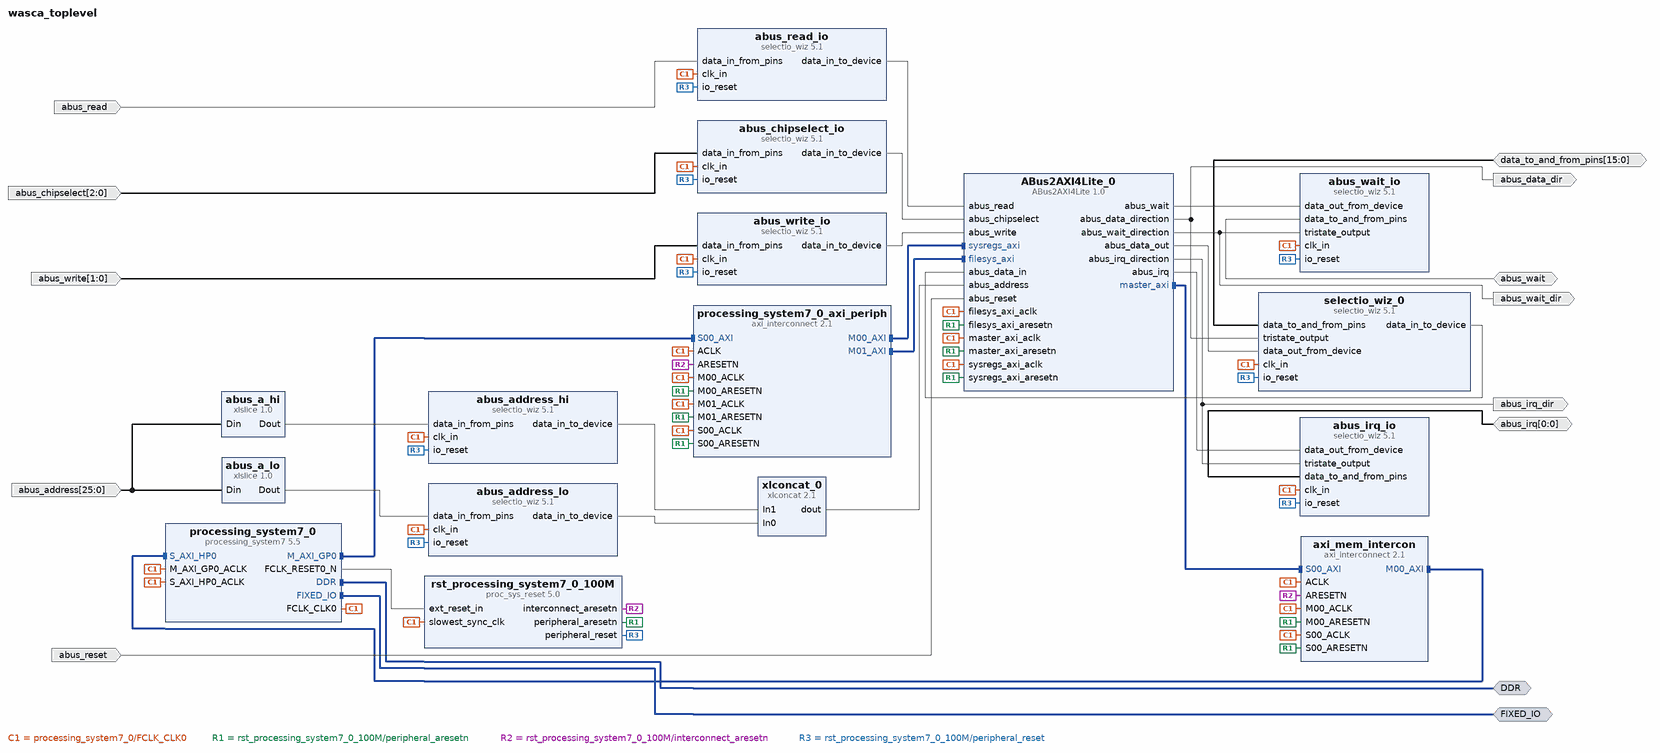
[diagram p0: block diagram of the top level]
# Vivado block design wasca_toplevel, Vivado 2016.2
create_bd_design wasca_toplevel

create_bd_intf_port -mode Master -vlnv xilinx.com:interface:ddrx_rtl:1.0 DDR
create_bd_intf_port -mode Master -vlnv xilinx.com:display_processing_system7:fixedio_rtl:1.0 FIXED_IO
create_bd_port -dir IO -from 15 -to 0 data_to_and_from_pins
create_bd_port -dir I -from 2 -to 0 abus_chipselect
create_bd_port -dir I abus_read
create_bd_port -dir I abus_reset
create_bd_port -dir IO -from 0 -to 0 abus_irq
create_bd_port -dir I -from 1 -to 0 abus_write
create_bd_port -dir IO abus_wait
create_bd_port -dir I -from 25 -to 0 abus_address
create_bd_port -dir O abus_data_dir
create_bd_port -dir O abus_irq_dir
create_bd_port -dir O abus_wait_dir

create_bd_cell -type ip -vlnv xilinx.com:ip:processing_system7:5.5 processing_system7_0
set_property -dict [list \
  CONFIG.PCW_FCLK_CLK0_BUF true \
  CONFIG.PCW_UIPARAM_DDR_FREQ_MHZ 400 \
  CONFIG.PCW_APU_PERIPHERAL_FREQMHZ 667 \
  CONFIG.PCW_SDIO_PERIPHERAL_FREQMHZ 100 \
  CONFIG.PCW_UART_PERIPHERAL_FREQMHZ 50 \
  CONFIG.PCW_FPGA0_PERIPHERAL_FREQMHZ 100 \
  CONFIG.PCW_FPGA1_PERIPHERAL_FREQMHZ 10 \
  CONFIG.PCW_FPGA2_PERIPHERAL_FREQMHZ 10 \
  CONFIG.PCW_FPGA3_PERIPHERAL_FREQMHZ 10 \
  CONFIG.PCW_USE_S_AXI_HP0 1 \
  CONFIG.PCW_S_AXI_HP0_DATA_WIDTH 32 \
  CONFIG.PCW_PRESET_BANK0_VOLTAGE {LVCMOS 1.8V} \
  CONFIG.PCW_PRESET_BANK1_VOLTAGE {LVCMOS 1.8V} \
  CONFIG.PCW_UIPARAM_DDR_MEMORY_TYPE {LPDDR 2} \
  CONFIG.PCW_UIPARAM_DDR_PARTNO Custom \
  CONFIG.PCW_QSPI_PERIPHERAL_ENABLE 1 \
  CONFIG.PCW_QSPI_GRP_SINGLE_SS_ENABLE 1 \
  CONFIG.PCW_QSPI_GRP_SINGLE_SS_IO {MIO 1 .. 6} \
  CONFIG.PCW_QSPI_GRP_FBCLK_ENABLE 1 \
  CONFIG.PCW_SD0_PERIPHERAL_ENABLE 1 \
  CONFIG.PCW_SD0_SD0_IO {MIO 16 .. 21} \
  CONFIG.PCW_SD0_GRP_WP_ENABLE 1 \
  CONFIG.PCW_SD0_GRP_WP_IO {MIO 22} \
  CONFIG.PCW_SD1_PERIPHERAL_ENABLE 1 \
  CONFIG.PCW_SD1_SD1_IO {MIO 10 .. 15} \
  CONFIG.PCW_UART0_PERIPHERAL_ENABLE 1 \
  CONFIG.PCW_UART0_UART0_IO {MIO 50 .. 51} \
  CONFIG.PCW_SPI0_PERIPHERAL_ENABLE 1 \
  CONFIG.PCW_SPI0_SPI0_IO {MIO 28 .. 33} \
  CONFIG.PCW_SPI0_GRP_SS1_ENABLE 1 \
  CONFIG.PCW_SPI0_GRP_SS2_ENABLE 1 \
  CONFIG.PCW_SPI1_PERIPHERAL_ENABLE 1 \
  CONFIG.PCW_SPI1_SPI1_IO {MIO 46 .. 51} \
  CONFIG.PCW_USB_RESET_ENABLE 1 \
  CONFIG.PCW_I2C_RESET_ENABLE 1 \
  CONFIG.PCW_GPIO_PERIPHERAL_ENABLE 1 \
  CONFIG.PCW_GPIO_MIO_GPIO_ENABLE 1 \
  CONFIG.PCW_GPIO_MIO_GPIO_IO MIO \
  CONFIG.PCW_GPIO_EMIO_GPIO_ENABLE 1 \
  CONFIG.PCW_GPIO_EMIO_GPIO_IO 64 \
] [get_bd_cells processing_system7_0]
# 157 more settings of processing_system7_0 are not shown: defaults, MIO pin electricals, DDR timing, and values the tool derives
create_bd_cell -type ip -vlnv xilinx.com:ip:axi_interconnect:2.1 axi_mem_intercon
set_property -dict {CONFIG.NUM_MI 1} [get_bd_cells axi_mem_intercon]
create_bd_cell -type ip -vlnv xilinx.com:ip:proc_sys_reset:5.0 rst_processing_system7_0_100M
create_bd_cell -type ip -vlnv xilinx.com:ip:selectio_wiz:5.1 selectio_wiz_0
set_property -dict [list \
  CONFIG.BUS_DIR BIDIR \
  CONFIG.BUS_IO_STD LVCMOS33 \
  CONFIG.SERIALIZATION_FACTOR 4 \
  CONFIG.SYSTEM_DATA_WIDTH 16 \
  CONFIG.SELIO_INTERFACE_TYPE NETWORKING \
  CONFIG.SELIO_BUS_IN_DELAY NONE \
  CONFIG.SELIO_CLK_IO_STD LVCMOS33 \
  CONFIG.SELIO_CLK_BUF MMCM \
  CONFIG.CLK_FWD false \
  CONFIG.CLK_FWD_IO_STD LVCMOS33 \
] [get_bd_cells selectio_wiz_0]
create_bd_cell -type ip -vlnv xilinx.com:ip:selectio_wiz:5.1 abus_wait_io
set_property -dict [list \
  CONFIG.BUS_DIR BIDIR \
  CONFIG.BUS_IO_STD LVCMOS33 \
  CONFIG.SERIALIZATION_FACTOR 4 \
  CONFIG.SYSTEM_DATA_WIDTH 1 \
  CONFIG.SELIO_INTERFACE_TYPE NETWORKING \
  CONFIG.SELIO_BUS_IN_DELAY NONE \
  CONFIG.SELIO_CLK_IO_STD LVCMOS33 \
  CONFIG.SELIO_CLK_BUF MMCM \
  CONFIG.CLK_FWD false \
  CONFIG.CLK_FWD_IO_STD LVCMOS33 \
] [get_bd_cells abus_wait_io]
create_bd_cell -type ip -vlnv xilinx.com:ip:selectio_wiz:5.1 abus_irq_io
set_property -dict [list \
  CONFIG.BUS_DIR BIDIR \
  CONFIG.BUS_IO_STD LVCMOS33 \
  CONFIG.SERIALIZATION_FACTOR 4 \
  CONFIG.SYSTEM_DATA_WIDTH 1 \
  CONFIG.SELIO_INTERFACE_TYPE NETWORKING \
  CONFIG.SELIO_BUS_IN_DELAY NONE \
  CONFIG.SELIO_CLK_IO_STD LVCMOS33 \
  CONFIG.SELIO_CLK_BUF MMCM \
  CONFIG.CLK_FWD false \
  CONFIG.CLK_FWD_IO_STD LVCMOS33 \
] [get_bd_cells abus_irq_io]
create_bd_cell -type ip -vlnv xilinx.com:ip:selectio_wiz:5.1 abus_read_io
set_property -dict [list \
  CONFIG.BUS_DIR INPUTS \
  CONFIG.BUS_IO_STD LVCMOS33 \
  CONFIG.SERIALIZATION_FACTOR 4 \
  CONFIG.SYSTEM_DATA_WIDTH 1 \
  CONFIG.SELIO_INTERFACE_TYPE NETWORKING \
  CONFIG.SELIO_BUS_IN_DELAY NONE \
  CONFIG.SELIO_CLK_IO_STD LVCMOS33 \
  CONFIG.SELIO_CLK_BUF MMCM \
  CONFIG.CLK_FWD false \
  CONFIG.CLK_FWD_IO_STD LVCMOS33 \
] [get_bd_cells abus_read_io]
create_bd_cell -type ip -vlnv xilinx.com:ip:selectio_wiz:5.1 abus_write_io
set_property -dict [list \
  CONFIG.BUS_DIR INPUTS \
  CONFIG.BUS_IO_STD LVCMOS33 \
  CONFIG.SERIALIZATION_FACTOR 4 \
  CONFIG.SYSTEM_DATA_WIDTH 2 \
  CONFIG.SELIO_INTERFACE_TYPE NETWORKING \
  CONFIG.SELIO_BUS_IN_DELAY NONE \
  CONFIG.SELIO_CLK_IO_STD LVCMOS33 \
  CONFIG.SELIO_CLK_BUF MMCM \
  CONFIG.CLK_FWD false \
  CONFIG.CLK_FWD_IO_STD LVCMOS33 \
] [get_bd_cells abus_write_io]
create_bd_cell -type ip -vlnv xilinx.com:ip:selectio_wiz:5.1 abus_chipselect_io
set_property -dict [list \
  CONFIG.BUS_DIR INPUTS \
  CONFIG.BUS_IO_STD LVCMOS33 \
  CONFIG.SERIALIZATION_FACTOR 4 \
  CONFIG.SYSTEM_DATA_WIDTH 3 \
  CONFIG.SELIO_INTERFACE_TYPE NETWORKING \
  CONFIG.SELIO_BUS_IN_DELAY NONE \
  CONFIG.SELIO_CLK_IO_STD LVCMOS33 \
  CONFIG.SELIO_CLK_BUF MMCM \
  CONFIG.CLK_FWD false \
  CONFIG.CLK_FWD_IO_STD LVCMOS33 \
] [get_bd_cells abus_chipselect_io]
create_bd_cell -type ip -vlnv xilinx.com:ip:xlconcat:2.1 xlconcat_0
create_bd_cell -type ip -vlnv xilinx.com:ip:selectio_wiz:5.1 abus_address_lo
set_property -dict [list \
  CONFIG.BUS_DIR INPUTS \
  CONFIG.BUS_IO_STD LVCMOS33 \
  CONFIG.SERIALIZATION_FACTOR 4 \
  CONFIG.SYSTEM_DATA_WIDTH 16 \
  CONFIG.SELIO_INTERFACE_TYPE NETWORKING \
  CONFIG.SELIO_BUS_IN_DELAY NONE \
  CONFIG.SELIO_CLK_IO_STD LVCMOS33 \
  CONFIG.SELIO_CLK_BUF MMCM \
  CONFIG.CLK_FWD false \
  CONFIG.CLK_FWD_IO_STD LVCMOS33 \
] [get_bd_cells abus_address_lo]
create_bd_cell -type ip -vlnv xilinx.com:ip:selectio_wiz:5.1 abus_address_hi
set_property -dict [list \
  CONFIG.BUS_DIR INPUTS \
  CONFIG.BUS_IO_STD LVCMOS33 \
  CONFIG.SERIALIZATION_FACTOR 4 \
  CONFIG.SYSTEM_DATA_WIDTH 10 \
  CONFIG.SELIO_INTERFACE_TYPE NETWORKING \
  CONFIG.SELIO_BUS_IN_DELAY NONE \
  CONFIG.SELIO_CLK_IO_STD LVCMOS33 \
  CONFIG.SELIO_CLK_BUF MMCM \
  CONFIG.CLK_FWD false \
  CONFIG.CLK_FWD_IO_STD LVCMOS33 \
] [get_bd_cells abus_address_hi]
create_bd_cell -type ip -vlnv xilinx.com:ip:xlslice:1.0 abus_a_lo
set_property -dict {CONFIG.DOUT_WIDTH 16 CONFIG.DIN_TO 0 CONFIG.DIN_FROM 15 CONFIG.DIN_WIDTH 26} [get_bd_cells abus_a_lo]
create_bd_cell -type ip -vlnv xilinx.com:ip:xlslice:1.0 abus_a_hi
set_property -dict {CONFIG.DOUT_WIDTH 10 CONFIG.DIN_TO 16 CONFIG.DIN_FROM 25 CONFIG.DIN_WIDTH 26} [get_bd_cells abus_a_hi]
create_bd_cell -type ip -vlnv xilinx.com:ip:axi_interconnect:2.1 processing_system7_0_axi_periph
set_property -dict {CONFIG.NUM_MI 2} [get_bd_cells processing_system7_0_axi_periph]
create_bd_cell -type ip -vlnv www.wasca.info:user:ABus2AXI4Lite:1.0 ABus2AXI4Lite_0

# ---- connections ----

connect_bd_intf_net [get_bd_intf_pins processing_system7_0/M_AXI_GP0] [get_bd_intf_pins processing_system7_0_axi_periph/S00_AXI]
connect_bd_intf_net [get_bd_intf_pins processing_system7_0_axi_periph/M00_AXI] [get_bd_intf_pins ABus2AXI4Lite_0/sysregs_axi]
connect_bd_intf_net [get_bd_intf_pins axi_mem_intercon/S00_AXI] [get_bd_intf_pins ABus2AXI4Lite_0/master_axi]
connect_bd_intf_net [get_bd_intf_pins processing_system7_0_axi_periph/M01_AXI] [get_bd_intf_pins ABus2AXI4Lite_0/filesys_axi]
connect_bd_intf_net [get_bd_intf_pins axi_mem_intercon/M00_AXI] [get_bd_intf_pins processing_system7_0/S_AXI_HP0]
connect_bd_intf_net [get_bd_intf_ports DDR] [get_bd_intf_pins processing_system7_0/DDR]
connect_bd_intf_net [get_bd_intf_ports FIXED_IO] [get_bd_intf_pins processing_system7_0/FIXED_IO]
connect_bd_net [get_bd_pins processing_system7_0/FCLK_CLK0] \
  [get_bd_pins processing_system7_0/M_AXI_GP0_ACLK] [get_bd_pins rst_processing_system7_0_100M/slowest_sync_clk] \
  [get_bd_pins selectio_wiz_0/clk_in] [get_bd_pins abus_wait_io/clk_in] [get_bd_pins abus_irq_io/clk_in] \
  [get_bd_pins abus_read_io/clk_in] [get_bd_pins abus_write_io/clk_in] [get_bd_pins abus_chipselect_io/clk_in] \
  [get_bd_pins abus_address_hi/clk_in] [get_bd_pins abus_address_lo/clk_in] [get_bd_pins axi_mem_intercon/S00_ACLK] \
  [get_bd_pins axi_mem_intercon/ACLK] [get_bd_pins axi_mem_intercon/M00_ACLK] \
  [get_bd_pins processing_system7_0_axi_periph/S00_ACLK] [get_bd_pins processing_system7_0_axi_periph/ACLK] \
  [get_bd_pins processing_system7_0_axi_periph/M00_ACLK] [get_bd_pins processing_system7_0_axi_periph/M01_ACLK] \
  [get_bd_pins processing_system7_0/S_AXI_HP0_ACLK] [get_bd_pins ABus2AXI4Lite_0/master_axi_aclk] \
  [get_bd_pins ABus2AXI4Lite_0/sysregs_axi_aclk] [get_bd_pins ABus2AXI4Lite_0/filesys_axi_aclk]
connect_bd_net [get_bd_pins processing_system7_0/FCLK_RESET0_N] [get_bd_pins rst_processing_system7_0_100M/ext_reset_in]
connect_bd_net [get_bd_pins rst_processing_system7_0_100M/peripheral_aresetn] \
  [get_bd_pins axi_mem_intercon/S00_ARESETN] [get_bd_pins axi_mem_intercon/M00_ARESETN] \
  [get_bd_pins processing_system7_0_axi_periph/S00_ARESETN] [get_bd_pins processing_system7_0_axi_periph/M00_ARESETN] \
  [get_bd_pins processing_system7_0_axi_periph/M01_ARESETN] [get_bd_pins ABus2AXI4Lite_0/master_axi_aresetn] \
  [get_bd_pins ABus2AXI4Lite_0/sysregs_axi_aresetn] [get_bd_pins ABus2AXI4Lite_0/filesys_axi_aresetn]
connect_bd_net [get_bd_pins rst_processing_system7_0_100M/interconnect_aresetn] \
  [get_bd_pins axi_mem_intercon/ARESETN] [get_bd_pins processing_system7_0_axi_periph/ARESETN]
connect_bd_net [get_bd_pins selectio_wiz_0/data_in_to_device] [get_bd_pins ABus2AXI4Lite_0/abus_data_in]
connect_bd_net [get_bd_pins ABus2AXI4Lite_0/abus_data_out] [get_bd_pins selectio_wiz_0/data_out_from_device]
connect_bd_net [get_bd_pins rst_processing_system7_0_100M/peripheral_reset] \
  [get_bd_pins selectio_wiz_0/io_reset] [get_bd_pins abus_wait_io/io_reset] [get_bd_pins abus_irq_io/io_reset] \
  [get_bd_pins abus_read_io/io_reset] [get_bd_pins abus_chipselect_io/io_reset] [get_bd_pins abus_write_io/io_reset] \
  [get_bd_pins abus_address_lo/io_reset] [get_bd_pins abus_address_hi/io_reset]
connect_bd_net [get_bd_pins ABus2AXI4Lite_0/abus_data_direction] [get_bd_pins selectio_wiz_0/tristate_output] [get_bd_ports abus_data_dir]
connect_bd_net [get_bd_ports data_to_and_from_pins] [get_bd_pins selectio_wiz_0/data_to_and_from_pins]
connect_bd_net [get_bd_ports abus_chipselect] [get_bd_pins abus_chipselect_io/data_in_from_pins]
connect_bd_net [get_bd_ports abus_read] [get_bd_pins abus_read_io/data_in_from_pins]
connect_bd_net [get_bd_ports abus_reset] [get_bd_pins ABus2AXI4Lite_0/abus_reset]
connect_bd_net [get_bd_pins ABus2AXI4Lite_0/abus_wait] [get_bd_pins abus_wait_io/data_out_from_device]
connect_bd_net [get_bd_pins ABus2AXI4Lite_0/abus_wait_direction] [get_bd_pins abus_wait_io/tristate_output] [get_bd_ports abus_wait_dir]
connect_bd_net [get_bd_ports abus_irq] [get_bd_pins abus_irq_io/data_to_and_from_pins]
connect_bd_net [get_bd_pins ABus2AXI4Lite_0/abus_irq_direction] [get_bd_pins abus_irq_io/tristate_output] [get_bd_ports abus_irq_dir]
connect_bd_net [get_bd_pins ABus2AXI4Lite_0/abus_irq] [get_bd_pins abus_irq_io/data_out_from_device]
connect_bd_net [get_bd_pins abus_read_io/data_in_to_device] [get_bd_pins ABus2AXI4Lite_0/abus_read]
connect_bd_net [get_bd_ports abus_write] [get_bd_pins abus_write_io/data_in_from_pins]
connect_bd_net [get_bd_pins abus_write_io/data_in_to_device] [get_bd_pins ABus2AXI4Lite_0/abus_write]
connect_bd_net [get_bd_pins abus_chipselect_io/data_in_to_device] [get_bd_pins ABus2AXI4Lite_0/abus_chipselect]
connect_bd_net [get_bd_ports abus_wait] [get_bd_pins abus_wait_io/data_to_and_from_pins]
connect_bd_net -net abus_address_lo_io_data_in_to_device [get_bd_pins abus_address_lo/data_in_to_device] [get_bd_pins xlconcat_0/In0]
connect_bd_net [get_bd_pins xlconcat_0/dout] [get_bd_pins ABus2AXI4Lite_0/abus_address]
connect_bd_net -net abus_address_hi_io1_data_in_to_device [get_bd_pins abus_address_hi/data_in_to_device] [get_bd_pins xlconcat_0/In1]
connect_bd_net [get_bd_ports abus_address] [get_bd_pins abus_a_lo/Din] [get_bd_pins abus_a_hi/Din]
connect_bd_net [get_bd_pins abus_a_lo/Dout] [get_bd_pins abus_address_lo/data_in_from_pins]
connect_bd_net [get_bd_pins abus_a_hi/Dout] [get_bd_pins abus_address_hi/data_in_from_pins]

# ---- address map ----
assign_bd_address -offset 0x00000000 -range 1G -target_address_space [get_bd_addr_spaces ABus2AXI4Lite_0/m00_axi] [get_bd_addr_segs processing_system7_0/S_AXI_HP0/HP0_DDR_LOWOCM]
assign_bd_address -offset 0x43C00000 -range 64K -target_address_space [get_bd_addr_spaces processing_system7_0/Data] [get_bd_addr_segs ABus2AXI4Lite_0/sysregs_axi/Reg]
assign_bd_address -offset 0x43C10000 -range 64K -target_address_space [get_bd_addr_spaces processing_system7_0/Data] [get_bd_addr_segs ABus2AXI4Lite_0/filesys_axi/Reg]

validate_bd_design
save_bd_design
